# Altium schematic sheet ArmDebuger(1-7)-POWER.SchDoc
size 393 x 241 mm
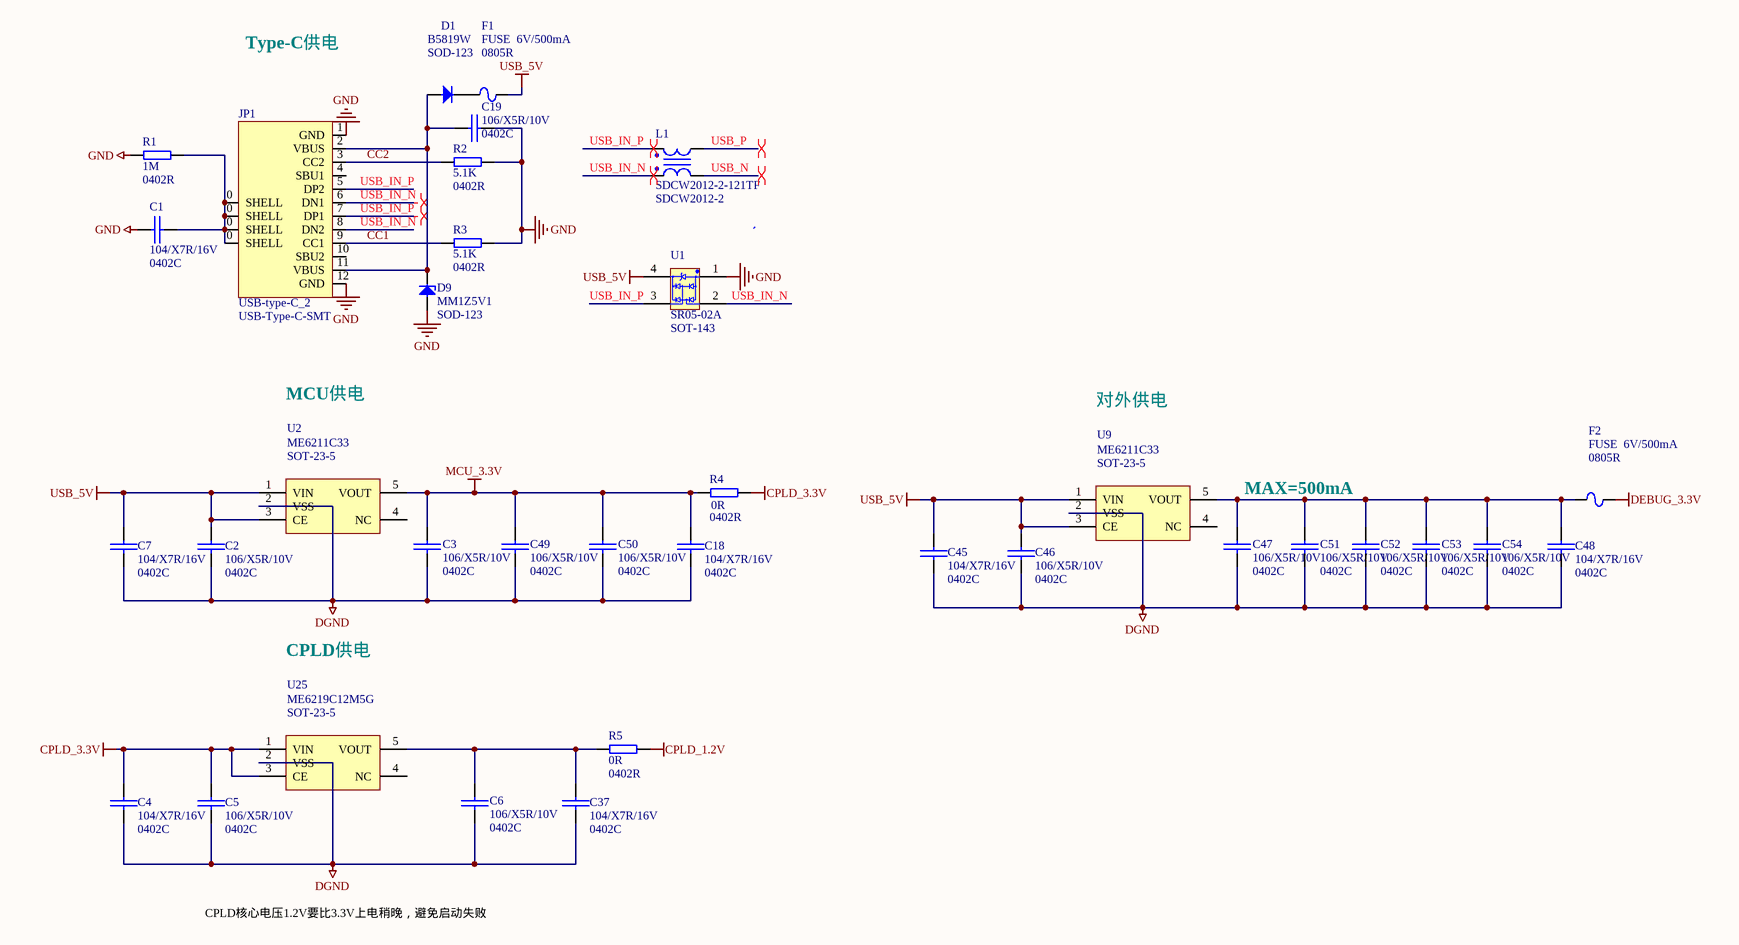
[diagram p0: ArmDebuger(1-7)-POWER.SchDoc]

## Parts
C1  104/X7R/16V  Fp: 0402C  [0402C-SMD-M]
C2  106/X5R/10V  Fp: 0402C  [0402C-SMD-M]
C3  106/X5R/10V  Fp: 0402C  [0402C-SMD-M]
C4  104/X7R/16V  Fp: 0402C  [0402C-SMD-M]
C5  106/X5R/10V  Fp: 0402C  [0402C-SMD-M]
C6  106/X5R/10V  Fp: 0402C  [0402C-SMD-M]
C7  104/X7R/16V  Fp: 0402C  [0402C-SMD-M]
C18  104/X7R/16V  Fp: 0402C  [0402C-SMD-M]
C19  106/X5R/10V  Fp: 0402C  [0402C-SMD-M]
C37  104/X7R/16V  Fp: 0402C  [0402C-SMD-M]
C45  104/X7R/16V  Fp: 0402C  [0402C-SMD-M]
C46  106/X5R/10V  Fp: 0402C  [0402C-SMD-M]
C47  106/X5R/10V  Fp: 0402C  [0402C-SMD-M]
C48  104/X7R/16V  Fp: 0402C  [0402C-SMD-M]
C49  106/X5R/10V  Fp: 0402C  [0402C-SMD-M]
C50  106/X5R/10V  Fp: 0402C  [0402C-SMD-M]
C51  106/X5R/10V  Fp: 0402C  [0402C-SMD-M]
C52  106/X5R/10V  Fp: 0402C  [0402C-SMD-M]
C53  106/X5R/10V  Fp: 0402C  [0402C-SMD-M]
C54  106/X5R/10V  Fp: 0402C  [0402C-SMD-M]
D1  B5819W  [SOD-123]
D9  MM1Z5V1  [SOD-123]
F1  FUSE  6V/500mA  Fp: 0805R  [0805R-SMD-M]
F2  FUSE  6V/500mA  Fp: 0805R  [0805R-SMD-M]
JP1  USB-type-C_2  [USB-Type-C-SMT]
L1  SDCW2012-2-121TF  [SDCW2012-2]
R1  1M  Fp: 0402R  [0402R-SMD-M]
R2  5.1K  Fp: 0402R  [0402R-SMD-M]
R3  5.1K  Fp: 0402R  [0402R-SMD-M]
R4  0R  Fp: 0402R  [0402R-SMD-M]
R5  0R  Fp: 0402R  [0402R-SMD-M]
U1  SR05-02A  [SOT-143]
U2  ME6211C33  [SOT-23-5]
U9  ME6211C33  [SOT-23-5]
U25  ME6219C12M5G  [SOT-23-5]

## Nets
CPLD_1.2V: R5.2
CPLD_3.3V: C4.2 C5.2 R4.2 U25.1(VIN) U25.3(CE)
DEBUG_3.3V: F2.2
DGND: C2.1 C3.2 C4.1 C5.1 C6.2 C7.1 C18.1 C37.1 C45.1 C46.1 C47.2 C48.1 C49.2 C50.2 C51.2 C52.2 C53.2 C54.2 U2.2(VSS) U9.2(VSS) U25.2(VSS)
GND: C1.1 C19.2 D9.1(A) JP1.1(GND) JP1.12(GND) R1.1 R2.2 R3.2 U1.1
MCU_3.3V: C3.1 C18.2 C49.1 C50.1 R4.1 U2.5(VOUT)
USB_5V: C2.2 C7.2 C45.2 C46.2 F1.2 U1.4 U2.1(VIN) U2.3(CE) U9.1(VIN) U9.3(CE)
CC1: JP1.9(CC1) R3.1
CC2: JP1.3(CC2) R2.1
USB_IN_N: JP1.6(DN1) JP1.8(DN2) L1.1 U1.2
USB_IN_P: JP1.5(DP2) JP1.7(DP1) L1.4 U1.3
USB_N: L1.2
USB_P: L1.3
NetC1_2: C1.2 JP1.0(SHELL) R1.2
NetC6_1: C6.1 C37.2 R5.1 U25.5(VOUT)
NetC19_1: C19.1 D1.1(A) D9.2(K) JP1.2(VBUS) JP1.11(VBUS)
NetC47_1: C47.1 C48.2 C51.1 C52.1 C53.1 C54.1 F2.1 U9.5(VOUT)
NetD1_2: D1.2(K) F1.1

Not connected (* = marked no-connect by the designer): JP1 4(SBU1) 10(SBU2); U2 4(NC); U9 4(NC); U25 4(NC)

## Layout directives
differential pair: USB_IN_N, USB_IN_P, USB_N, USB_P

## Notes on the sheet
- Type-C供电
- MCU供电
- 对外供电
- MAX=500mA
- CPLD供电
- CPLD核心电压1.2V要比3.3V上电稍晚，避免启动失败

## Library data of the parts
C1 C4 C7 C18 C37 C45 C48 = CAP: P/N: 06075; LCSC: C60474
C2 C3 C5 C6 C19 C46 C47 C49-C54 = CAP: LCSC: C29266; P/N: ?
D1 = DIODE: P/N: 02036; Fp: SOD-123; LCSC: C8598
D9 = ZENER: P/N: 02031; Fp: SOD-123; LCSC: C112534
F1 F2 = FUSE: LCSC: C66452; P/N: ?
L1 = COMMON MODE COIL: P/N: 09016; Fp: SDCW2012-2; LCSC: C145052
R1 = RES: P/N: 04075; LCSC: C3152068
R2 R3 = RES: P/N: 04160; LCSC: C25905
R4 R5 = RES: P/N: 04150; LCSC: C21376
U1 = SR05-02A: P/N: 02064; Fp: SOT-143; LCSC: C521962
U2 U9 = ME6211: P/N: 01053; Fp: SOT-23-5; LCSC: C82942
U25 = ME6211: P/N: 01128; Fp: SOT-23-5; LCSC: C236651
JP1 = USB-type-C_2: Fp: USB-Type-C-SMT; LCSC: C2765186; P/N: ?